# Altium project ToF_Board.PrjPcb
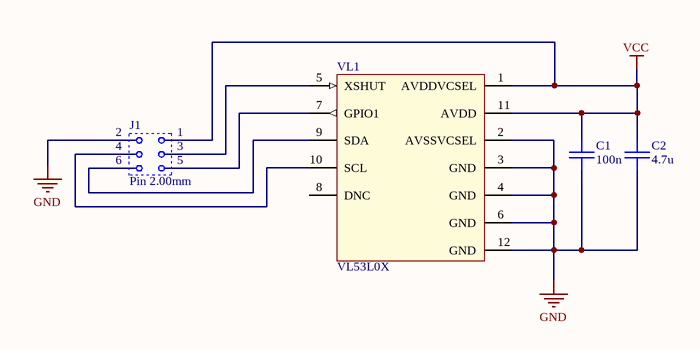
[diagram p0: ToF_Board.SchDoc]
1 sheet, 4 parts. Net scope: global (net labels, ports and power ports of the same name join across sheets).
Board file: ToF_Board.PcbDoc

## Sheet ToF_Board.SchDoc
size A4; Organization: Altium Limited; Address1: L3, 12a Rodborough Rd; Address2: Frenchs Forest; Address3: NSW; Address4: Australia 2086

### Parts
C1  100n  [0603]
C2  4.7u  [0603]
J1  Pin 2.00mm  [2mmEdgePCB6Pin]
VL1  VL53L0X  [LGA12]

### Nets
GND: C1.2 C2.2 J1.2 VL1.2(AVSSVCSEL) VL1.3(GND) VL1.4(GND) VL1.6(GND) VL1.12(GND)
VCC: C1.1 C2.1 J1.1 VL1.1(AVDDVCSEL) VL1.11(AVDD)
NetJ1_3: J1.3 VL1.5(XSHUT)
NetJ1_4: J1.4 VL1.10(SCL)
NetJ1_5: J1.5 VL1.7(GPIO1)
NetJ1_6: J1.6 VL1.9(SDA)

Not connected (* = marked no-connect by the designer): VL1 8(DNC)

### Notes on the sheet
- Title
- Size:
- Date:
- A4
- Number:
- Time:
- Revision:
- Sheet
- of
- File:

### Library data of the parts
C1 C2 = C_CER: Ceramic Capacitor
J1 = Goldpin 2.00 pin 2x3: Symbol: NINIGI ZL303-2X10P; Supplier: TME; URL: http://www.tme.eu/pl/details/zl303-2x10p/listwy-i-gniazda-kolkowe/ninigi/#
VL1 = VL53L0X ToF: Time-of-Flight ranging and gesture detection sensor; Supplier: Farnell; URL: http://pl.farnell.com/stmicroelectronics/vl53l0cxv0dh-1/gesture-detection-sensor-digital/dp/2762754?st=VL53L0X